# Altium schematic sheet usb_main_connector.SchDoc
size A3
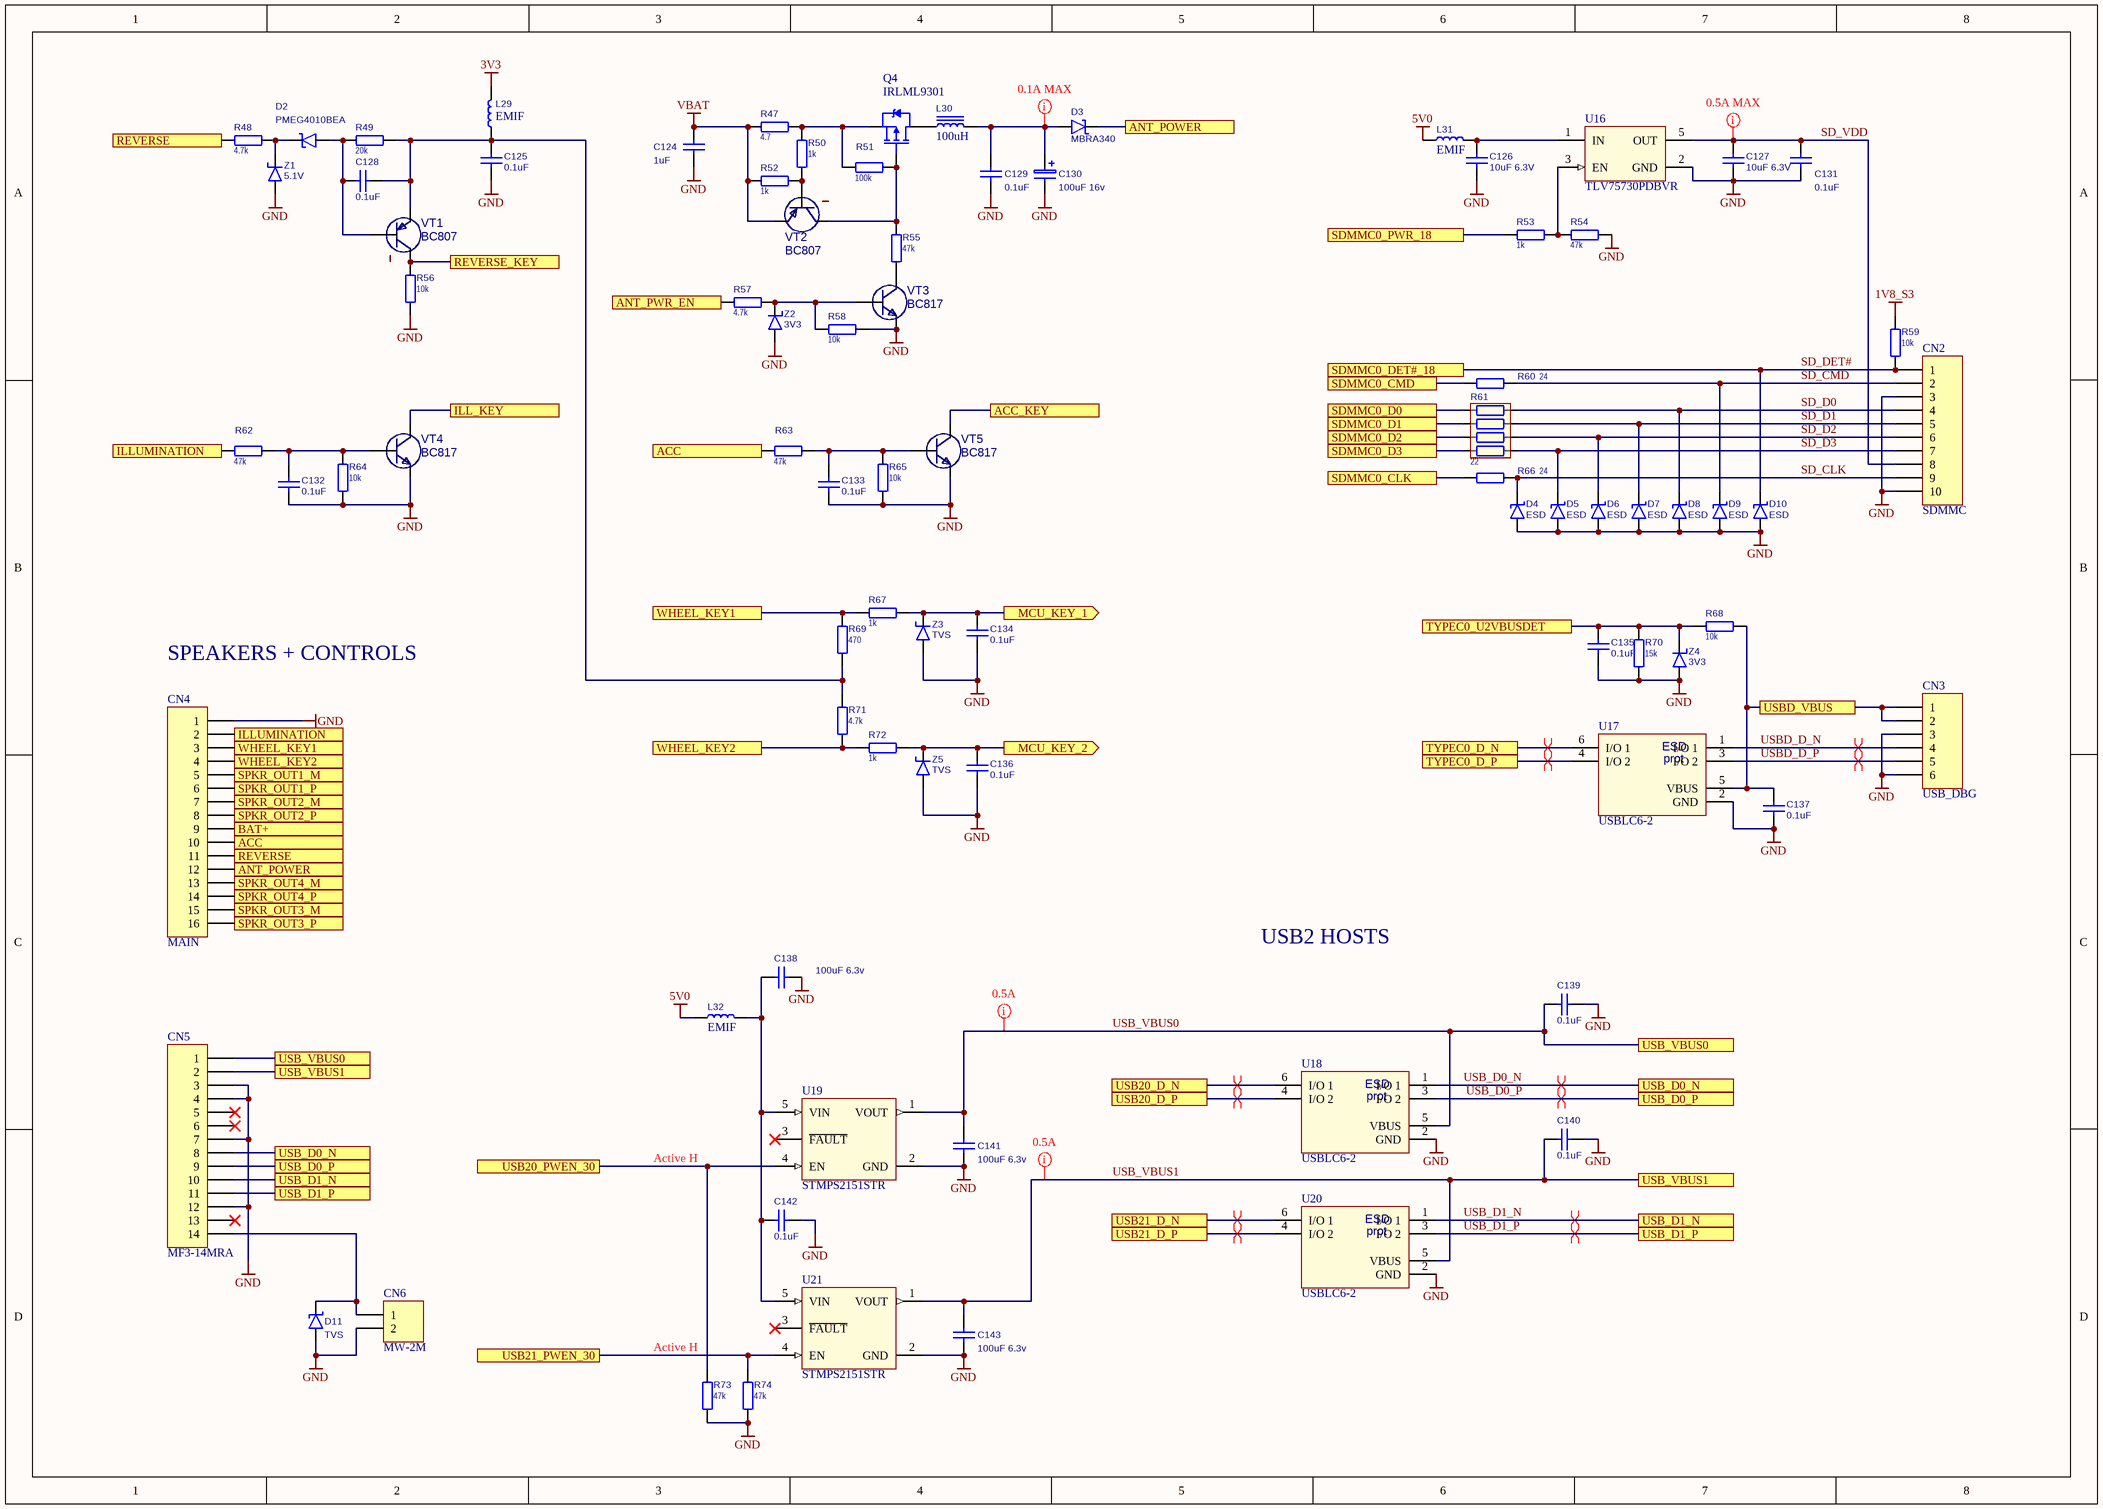
[diagram p0: usb_main_connector.SchDoc]

## Parts
C124  value 1uF  [C0603]  (hidden comment: CC0603KRX7R9BB105)
C125  value 0.1uF  [C0603]  (hidden comment: C1608X7R1H104K080AA)
C126  value 10uF 6.3V  [C0603]  (hidden comment: CC0603MRX5R5BB106)
C127  value 10uF 6.3V  [C0603]  (hidden comment: CC0603MRX5R5BB106)
C128  value 0.1uF  [C0603]  (hidden comment: C1608X7R1H104K080AA)
C129  value 0.1uF  [C0603]  (hidden comment: C1608X7R1H104K080AA)
C130  value 100uF 16v  [R05H11]  (hidden comment: ECAP 100/16V 0511 105'C)
C131  value 0.1uF  [C0603]  (hidden comment: C1608X7R1H104K080AA)
C132  value 0.1uF  [C0603]  (hidden comment: C1608X7R1H104K080AA)
C133  value 0.1uF  [C0603]  (hidden comment: C1608X7R1H104K080AA)
C134  value 0.1uF  [C0603]  (hidden comment: C1608X7R1H104K080AA)
C135  value 0.1uF  [C0603]  (hidden comment: C1608X7R1H104K080AA)
C136  value 0.1uF  [C0603]  (hidden comment: C1608X7R1H104K080AA)
C137  value 0.1uF  [C0603]  (hidden comment: C1608X7R1H104K080AA)
C138  value 100uF 6.3v  [C1206]  (hidden comment: CL31A107MQHNNNE)
C139  value 0.1uF  [C0603]  (hidden comment: C1608X7R1H104K080AA)
C140  value 0.1uF  [C0603]  (hidden comment: C1608X7R1H104K080AA)
C141  value 100uF 6.3v  [C1206]  (hidden comment: CL31A107MQHNNNE)
C142  value 0.1uF  [C0603]  (hidden comment: C1608X7R1H104K080AA)
C143  value 100uF 6.3v  [C1206]  (hidden comment: CL31A107MQHNNNE)
CN2  SDMMC  [10S-0.5SH]
CN3  USB_DBG  [6S-0.5SH]
CN4  MAIN  [43045-1600]
CN5  MF3-14MRA  [43045-1400]
CN6  MW-2M  [MW-2M]
D2  value PMEG4010BEA  [SOD-323]  (hidden comment: PMEG4010BEA.115)
D3  MBRA340  [SMA]
D4  value ESD  [SOD-923]  (hidden comment: TPD1E04U04)
D5  value ESD  [SOD-923]  (hidden comment: TPD1E04U04)
D6  value ESD  [SOD-923]  (hidden comment: TPD1E04U04)
D7  value ESD  [SOD-923]  (hidden comment: TPD1E04U04)
D8  value ESD  [SOD-923]  (hidden comment: TPD1E04U04)
D9  value ESD  [SOD-923]  (hidden comment: TPD1E04U04)
D10  value ESD  [SOD-923]  (hidden comment: TPD1E04U04)
D11  value TVS  [SOD-323]  (hidden comment: CDSOD323-T05LC)
L29  value EMIF  [IND0603]  (hidden comment: BLM18AG102SN1D)
L30  value 100uH  [CDRH4D28]  (hidden comment: CDRH4D28C/LDNP-101PC)
L31  value EMIF  [IND0603]  (hidden comment: BLM18AG102SN1D)
L32  value EMIF  [IND1206]  (hidden comment: BLM31PG391SN1L)
Q4  IRLML9301  [SOT-23-3]
R47  4.7  [R1206]
R48  4.7k  [R0603]
R49  20k  [R0603]
R50  1k  [R0603]
R51  100k  [R0603]
R52  1k  [R0603]
R53  1k  [R0603]
R54  47k  [R0603]
R55  47k  [R0603]
R56  10k  [R0603]
R57  4.7k  [R0603]
R58  10k  [R0603]
R59  10k  [R0603]
R60  24  [R0603]
R61  value 22  [R0804X4]  (hidden comment: TC124-JR-0722RL)
R62  47k  [R0603]
R63  47k  [R0603]
R64  10k  [R0603]
R65  10k  [R0603]
R66  24  [R0603]
R67  1k  [R0603]
R68  10k  [R0603]
R69  470  [R0603]
R70  15k  [R0603]
R71  4.7k  [R0603]
R72  1k  [R0603]
R73  value 47k  [R0603]  (hidden comment: 10k)
R74  value 47k  [R0603]  (hidden comment: 10k)
U16  TLV75730PDBVR  [SOT-23-5]
U17  USBLC6-2  [SOT-23-6]
U18  USBLC6-2  [SOT-23-6]
U19  STMPS2151STR  [SOT-23-5]
U20  USBLC6-2  [SOT-23-6]
U21  STMPS2151STR  [SOT-23-5]
VT1  BC807  [SOT-23-3]
VT2  BC807  [SOT-23-3]
VT3  BC817  [SOT-23-3]
VT4  BC817  [SOT-23-3]
VT5  BC817  [SOT-23-3]
Z1  value 5.1V  [SOD-323]  (hidden comment: BZX384-C5V1.115)
Z2  value 3V3  [SOD-323]  (hidden comment: BZX384-C3V3.115)
Z3  value TVS  [SOD-323]  (hidden comment: CDSOD323-T05LC)
Z4  value 3V3  [SOD-323]  (hidden comment: BZX384-C3V3.115)
Z5  value TVS  [SOD-323]  (hidden comment: CDSOD323-T05LC)

## Ports
ACC, ACC_KEY, ANT_POWER, ANT_PWR_EN, BAT+, ILL_KEY, ILLUMINATION, MCU_KEY_1 (out), MCU_KEY_2 (out), REVERSE, REVERSE_KEY, SDMMC0_CLK, SDMMC0_CMD, SDMMC0_D0, SDMMC0_D1, SDMMC0_D2, SDMMC0_D3, SDMMC0_DET#_18, SDMMC0_PWR_18, SPKR_OUT1_M, SPKR_OUT1_P, SPKR_OUT2_M, SPKR_OUT2_P, SPKR_OUT3_M, SPKR_OUT3_P, SPKR_OUT4_M, SPKR_OUT4_P, TYPEC0_D_N, TYPEC0_D_P, TYPEC0_U2VBUSDET, USB20_D_N, USB20_D_P, USB20_PWEN_30, USB21_D_N, USB21_D_P, USB21_PWEN_30, USB_D0_N, USB_D0_P, USB_D1_N, USB_D1_P, USB_VBUS0, USB_VBUS1, USBD_VBUS, WHEEL_KEY1, WHEEL_KEY2

## Nets
1V8_S3: R59.2
3V3: L29.2
5V0: L31.1 L32.2
GND: C124.1 C125.1 C126.2 C127.2 C129.1 C130.2(-) C131.1 C132.2 C133.2 C134.2 C135.2 C136.2 C137.2 C138.1 C139.2 C140.2 C141.1 C142.2 C143.1 CN2.3 CN2.10 CN3.3 CN3.6 CN4.1 CN5.3 CN5.4 CN5.7 CN5.12 CN6.2 D4.1(A) D5.1(A) D6.1(A) D7.1(A) D8.1(A) D9.1(A) D10.1(A) D11.1(A) R54.2 R56.2 R58.1 R64.1 R65.1 R70.1 R73.2 R74.2 U16.2(GND) U17.2(GND) U18.2(GND) U19.2(GND) U20.2(GND) U21.2(GND) VT3.2 VT4.2 VT5.2 Z1.1(A) Z2.1(A) Z3.1(A) Z4.1(A) Z5.1(A)
VBAT: C124.2 R47.2 R52.2 VT2.2(E)
ACC: CN4.10 R63.1 ; port ACC
ACC_KEY: VT5.3 ; port ACC_KEY
ANT_POWER: CN4.12 D3.2(K) ; port ANT_POWER
ANT_PWR_EN: R57.2 ; port ANT_PWR_EN
BAT+: CN4.9 ; port BAT+
ILL_KEY: VT4.3 ; port ILL_KEY
ILLUMINATION: CN4.2 R62.1 ; port ILLUMINATION
MCU_KEY_1: C134.1 R67.2 Z3.2(K) ; port MCU_KEY_1
MCU_KEY_2: C136.1 R72.2 Z5.2(K) ; port MCU_KEY_2
REVERSE: CN4.11 R48.1 ; port REVERSE
REVERSE_KEY: R56.1 VT1.3 ; port REVERSE_KEY
SD_CLK: CN2.9 D4.2(K) R66.1
SD_CMD: CN2.2 D9.2(K) R60.1
SD_D0: CN2.4 D8.2(K) R61.7
SD_D1: CN2.5 D7.2(K) R61.5
SD_D2: CN2.6 D6.2(K) R61.3
SD_D3: CN2.7 D5.2(K) R61.1
SD_DET#: CN2.1 D10.2(K) R59.1 ; port SDMMC0_DET#_18
SD_VDD: C127.1 C131.2 CN2.8 U16.5(OUT)
SDMMC0_CLK: R66.2 ; port SDMMC0_CLK
SDMMC0_CMD: R60.2 ; port SDMMC0_CMD
SDMMC0_D0: R61.8 ; port SDMMC0_D0
SDMMC0_D1: R61.6 ; port SDMMC0_D1
SDMMC0_D2: R61.4 ; port SDMMC0_D2
SDMMC0_D3: R61.2 ; port SDMMC0_D3
SDMMC0_PWR_18: R53.1 ; port SDMMC0_PWR_18
SPKR_OUT1_M: CN4.5 ; port SPKR_OUT1_M
SPKR_OUT1_P: CN4.6 ; port SPKR_OUT1_P
SPKR_OUT2_M: CN4.7 ; port SPKR_OUT2_M
SPKR_OUT2_P: CN4.8 ; port SPKR_OUT2_P
SPKR_OUT3_M: CN4.15 ; port SPKR_OUT3_M
SPKR_OUT3_P: CN4.16 ; port SPKR_OUT3_P
SPKR_OUT4_M: CN4.13 ; port SPKR_OUT4_M
SPKR_OUT4_P: CN4.14 ; port SPKR_OUT4_P
TYPEC0_D_N: U17.6(I/O_1) ; port TYPEC0_D_N
TYPEC0_D_P: U17.4(I/O_2) ; port TYPEC0_D_P
TYPEC0_U2VBUSDET: C135.1 R68.2 R70.2 Z4.2(K) ; port TYPEC0_U2VBUSDET
USB20_D_N: U18.6(I/O_1) ; port USB20_D_N
USB20_D_P: U18.4(I/O_2) ; port USB20_D_P
USB20_PWEN_30: R73.1 U19.4(EN) ; port USB20_PWEN_30
USB21_D_N: U20.6(I/O_1) ; port USB21_D_N
USB21_D_P: U20.4(I/O_2) ; port USB21_D_P
USB21_PWEN_30: R74.1 U21.4(EN) ; port USB21_PWEN_30
USB_D0_N: CN5.8 U18.1(I/O_1) ; port USB_D0_N
USB_D0_P: CN5.9 U18.3(I/O_2) ; port USB_D0_P
USB_D1_N: CN5.10 U20.1(I/O_1) ; port USB_D1_N
USB_D1_P: CN5.11 U20.3(I/O_2) ; port USB_D1_P
USB_VBUS0: C139.1 C141.2 CN5.1 U18.5(VBUS) U19.1(VOUT) ; port USB_VBUS0
USB_VBUS1: C140.1 C143.2 CN5.2 U20.5(VBUS) U21.1(VOUT) ; port USB_VBUS1
USBD_D_N: CN3.4 U17.1(I/O_1)
USBD_D_P: CN3.5 U17.3(I/O_2)
USBD_VBUS: C137.1 CN3.1 CN3.2 R68.1 U17.5(VBUS) ; port USBD_VBUS
WHEEL_KEY1: CN4.3 R67.1 R69.1 ; port WHEEL_KEY1
WHEEL_KEY2: CN4.4 R71.2 R72.1 ; port WHEEL_KEY2
NetC125_2: C125.2 C128.1 L29.1 R49.2 R69.2 R71.1 VT1.2
NetC126_1: C126.1 L31.2 U16.1(IN)
NetC128_2: C128.2 D2.1(A) R49.1 VT1.1
NetC129_2: C129.2 C130.1(+) D3.1(A) L30.2
NetC132_1: C132.1 R62.2 R64.2 VT4.1
NetC133_1: C133.1 R63.2 R65.2 VT5.1
NetC138_2: C138.2 C142.1 L32.1 U19.5(VIN) U21.5(VIN)
NetCN5_14: CN5.14 CN6.1 D11.2(K)
NetD2_2: D2.2(K) R48.2 Z1.2(K)
NetL30_1: L30.1 Q4.3(D)
NetQ4_1: Q4.1(G) R51.2 R55.2 VT2.3(K)
NetQ4_2: Q4.2(S) R47.1 R50.1 R51.1
NetR50_2: R50.2 R52.1 VT2.1(B)
NetR53_2: R53.2 R54.1 U16.3(EN)
NetR55_1: R55.1 VT3.3
NetR57_1: R57.1 R58.2 VT3.1 Z2.2(K)

Not connected (* = marked no-connect by the designer): CN5 5* 6* 13*; U19 3(~{FAULT})*; U21 3(~{FAULT})*

## Layout directives
mark named 0.1A MAX: NetC129_2
differential pair: TYPEC0_D_N, TYPEC0_D_P, USB20_D_N, USB20_D_P, USB21_D_N, USB21_D_P, USB_D0_N, USB_D0_P, USB_D1_N, USB_D1_P, USBD_D_N, USBD_D_P
mark named 0.5A: USB_VBUS0, USB_VBUS1
mark named 0.5A MAX: SD_VDD

## Notes on the sheet
- SPEAKERS + CONTROLS
- USB2 HOSTS
- Active H
- (near R73) Active H
- (in symbol USBLC6-2) ESD; prot

## Library data of the parts
C124-C129 C131-C143 = CAP_NPOL
C130 = CAP_POL
CN2 = HDR 10: Header, 10-Pin; LatestRevisionDate: 17-Jul-2002; LatestRevisionNote: Re-released for DXP Platform.; Publisher: Altium Limited
CN3 = HDR 6: Header, 6-Pin; LatestRevisionDate: 17-Jul-2002; LatestRevisionNote: Re-released for DXP Platform.; Publisher: Altium Limited
CN4 = HDR 16: Header, 16-Pin; LatestRevisionDate: 17-Jul-2002; LatestRevisionNote: Re-released for DXP Platform.; Publisher: Altium Limited
CN5 = HDR 14: Header, 14-Pin; LatestRevisionDate: 17-Jul-2002; LatestRevisionNote: Re-released for DXP Platform.; Publisher: Altium Limited
CN6 = HDR 2: Header, 2-Pin; LatestRevisionDate: 17-Jul-2002; LatestRevisionNote: Re-released for DXP Platform.; Publisher: Altium Limited
D2-D11 = SHOTTKY
  D3: Value: MBRA340
L29 L31 L32 = IND_WO_IRON
L30 = IND_W_IRON
Q4 = P-Channel: HEXFET Power MOSFET
R47-R60 R62-R74 = RESISTOR: RES
  R47: Value: 4.7
  R48 R57 R71: Value: 4.7k
  R49: Value: 20k
  R50 R52 R53 R67 R72: Value: 1k
  R51: Value: 100k
  R54 R55 R62 R63: Value: 47k
  R56 R58 R59 R64 R65 R68: Value: 10k
  R60 R66: Value: 24
  R69: Value: 470
  R70: Value: 15k
R61 = ARRAY
U16 = TLV733P: Capacitor-Free, 300-mA, Low-Dropout Regulator with Foldback Current Limit for Portable Devices; value: TLV733P
U17 U18 U20 = USBLC6-2: Ultralow capacitance ESD protection; value: USBLC6-2
U19 U21 = STMPS21x1STR: value: STMPS21x1STR
VT1 VT2 = P-N-P: Bipolar transistor P-N-P; Value: BC807
VT3-VT5 = N-P-N: Bipolar transistor N-P-N; Value: BC817
Z1-Z5 = ZENNER_1: ZENNER